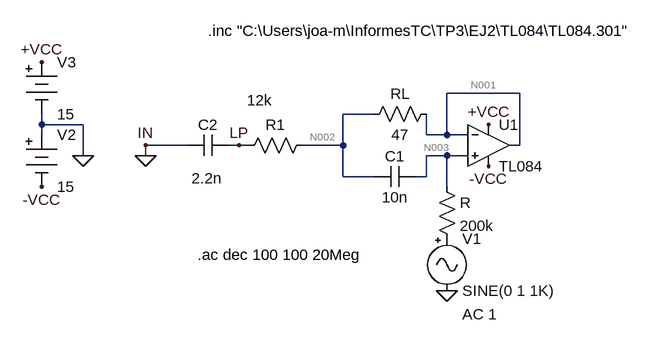
[diagram p0: schematic gyrator_lowpass.asc]
gyrator_lowpass.asc, the LTspice schematic file:
Version 4
SHEET 1 880 680
WIRE 192 80 80 80
WIRE -32 112 -80 112
WIRE -544 128 -544 112
WIRE -480 128 -544 128
WIRE -544 144 -544 128
WIRE 48 144 48 112
WIRE 80 144 80 80
WIRE 80 144 48 144
WIRE 112 144 80 144
WIRE -320 160 -384 160
WIRE -240 160 -256 160
WIRE -224 160 -240 160
WIRE -80 160 -80 112
WIRE -80 160 -144 160
WIRE 192 160 192 80
WIRE 192 160 176 160
WIRE -480 176 -480 128
WIRE -384 176 -384 160
WIRE 80 176 48 176
WIRE 112 176 80 176
WIRE -80 208 -80 160
WIRE -32 208 -80 208
WIRE 48 208 48 176
WIRE 48 208 32 208
WIRE 80 224 80 176
FLAG 80 384 0
FLAG -384 176 0
FLAG -544 32 +VCC
FLAG -544 224 -VCC
FLAG -480 176 0
FLAG -384 160 IN
FLAG 144 128 +VCC
FLAG 144 192 -VCC
FLAG -240 160 LP
SYMBOL res 64 96 R90
WINDOW 0 0 56 VBottom 2
WINDOW 3 32 56 VTop 2
SYMATTR InstName RL
SYMATTR Value 47
SYMBOL res 64 208 R0
SYMATTR InstName R
SYMATTR Value 200k
SYMBOL cap 32 192 R90
WINDOW 0 0 32 VBottom 2
WINDOW 3 32 32 VTop 2
SYMATTR InstName C1
SYMATTR Value 10n
SYMBOL res -128 144 R90
WINDOW 0 0 56 VBottom 2
WINDOW 3 -69 80 VTop 2
SYMATTR InstName R1
SYMATTR Value 12k
SYMBOL cap -256 144 R90
WINDOW 0 0 32 VBottom 2
WINDOW 3 51 34 VTop 2
SYMATTR InstName C2
SYMATTR Value 2.2n
SYMBOL Misc\\signal 80 288 R0
WINDOW 123 24 132 Left 2
WINDOW 39 0 0 Left 0
SYMATTR Value2 AC 1
SYMATTR InstName V1
SYMBOL Misc\\battery -544 128 R0
WINDOW 123 0 0 Left 0
WINDOW 39 0 0 Left 0
SYMATTR InstName V2
SYMATTR Value 15
SYMBOL Misc\\battery -544 16 R0
WINDOW 123 0 0 Left 0
WINDOW 39 0 0 Left 0
SYMATTR InstName V3
SYMATTR Value 15
SYMBOL Opamps\\opamp2 144 96 R0
SYMATTR InstName U1
SYMATTR Value TL084
SYMATTR SpiceModel TL084
TEXT -304 328 Left 2 !.ac dec 100 100 20Meg
TEXT -288 -16 Left 2 !.inc "C:\\Users\\joa-m\\InformesTC\\TP3\\EJ2\\TL084\\TL084.301"

The netlist it stands for:
* gyrator_lowpass.asc
RL N001 N002 47
R N003 P001 200k
C1 N003 N002 10n
R1 N002 LP 12k
C2 LP 0 2.2n
V1 P001 0 SINE(0 1 1K) AC 1
V2 0 -VCC 15
V3 +VCC 0 15
XU1 N003 N001 +VCC -VCC N001 TL084 TL084  ; pins In+ In- V+ V- OUT
.ac dec 100 100 20Meg
.inc "C:\Users\joa-m\InformesTC\TP3\EJ2\TL084\TL084.301"
.backanno
.end

* Results of the author's LTspice run, read from the files saved beside the schematic
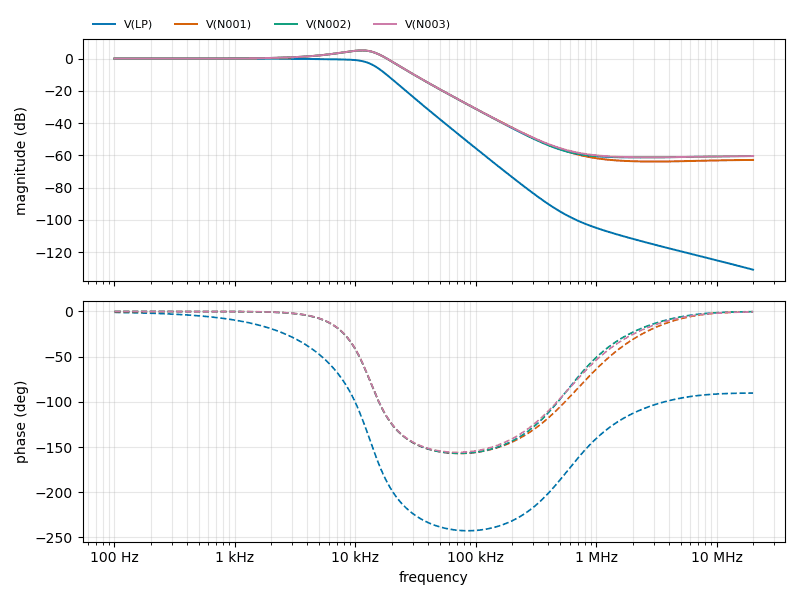
[diagram p1: AC Analysis of gyrator_lowpass.asc, plotted from the saved traces]
* AC Analysis, 1 run:
*   V(LP): -0.00 dB at 100 Hz, -130.80 dB at 20 MHz, peak -0.00 dB at 100 Hz, 3 dB below the peak at 13.13 kHz
*   V(N001): 0.00 dB at 100 Hz, -62.78 dB at 20 MHz, peak 5.08 dB at 11.22 kHz, 3 dB below the peak at 5.143 kHz and 16.25 kHz
*   V(N002): 0.00 dB at 100 Hz, -60.38 dB at 20 MHz, peak 5.05 dB at 11.22 kHz, 3 dB below the peak at 5.122 kHz and 16.24 kHz
*   V(N003): 0.00 dB at 100 Hz, -60.38 dB at 20 MHz, peak 5.08 dB at 11.22 kHz, 3 dB below the peak at 5.143 kHz and 16.25 kHz